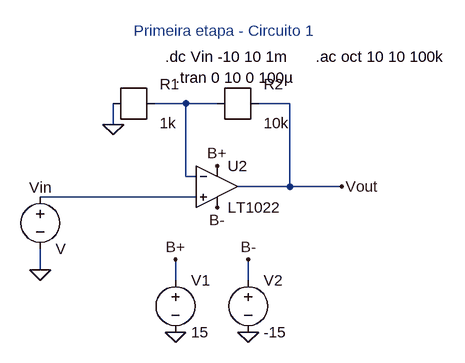
[diagram p0: schematic Lab3_ex1_1.asc]
Lab3_ex1_1.asc, the LTspice schematic file:
Version 4
SHEET 1 880 680
WIRE 416 224 368 224
WIRE 464 224 416 224
WIRE 576 224 528 224
WIRE 304 256 304 224
WIRE 416 336 416 224
WIRE 432 336 416 336
WIRE 576 352 576 224
WIRE 576 352 496 352
WIRE 656 352 576 352
WIRE 432 368 192 368
WIRE 192 480 192 448
WIRE 400 496 400 464
WIRE 512 496 512 464
FLAG 512 576 0
FLAG 400 576 0
FLAG 512 464 B-
FLAG 400 464 B+
FLAG 464 384 B-
FLAG 464 320 B+
FLAG 304 256 0
FLAG 192 480 0
FLAG 656 352 Vout
SYMBOL opamps/LT1022 464 288 R0
SYMATTR InstName U2
SYMBOL voltage 400 480 R0
SYMATTR InstName V1
SYMATTR Value 15
SYMBOL voltage 512 480 R0
SYMATTR InstName V2
SYMATTR Value -15
SYMBOL r 304 224 R0
SYMATTR InstName R1
SYMATTR Value 1k
SYMBOL r 464 224 R0
SYMATTR InstName R2
SYMATTR Value 10k
SYMBOL voltage 192 352 R0
WINDOW 0 -17 1 Left 2
SYMATTR InstName Vin
TEXT 384 152 Left 2 !.dc Vin -10 10 1m
TEXT 336 112 Left 2 ;Primeira etapa - Circuito 1
TEXT 400 184 Left 2 !.tran 0 10 0 100µ
TEXT 616 152 Left 2 !.ac oct 10 10 100k

The netlist it stands for:
* Lab3_ex1_1.asc
XU2 N002 N001 B+ B- Vout LT1022  ; pins In+ In- V+ V- OUT
V1 B+ 0 15
V2 B- 0 -15
R1 N001 0 1k
R2 Vout N001 10k
Vin N002 0 V
.dc Vin -10 10 1m
* Primeira etapa - Circuito 1
.tran 0 10 0 100µ
.ac oct 10 10 100k
.backanno
.end